# Altium schematic sheet Sheet1.SchDoc: GAS LEAKAGE SETECTOR
size A4; DrawnBy: M.W.R.Prabuddhika; Revision: 1; SheetNumber: 1; SheetTotal: 1
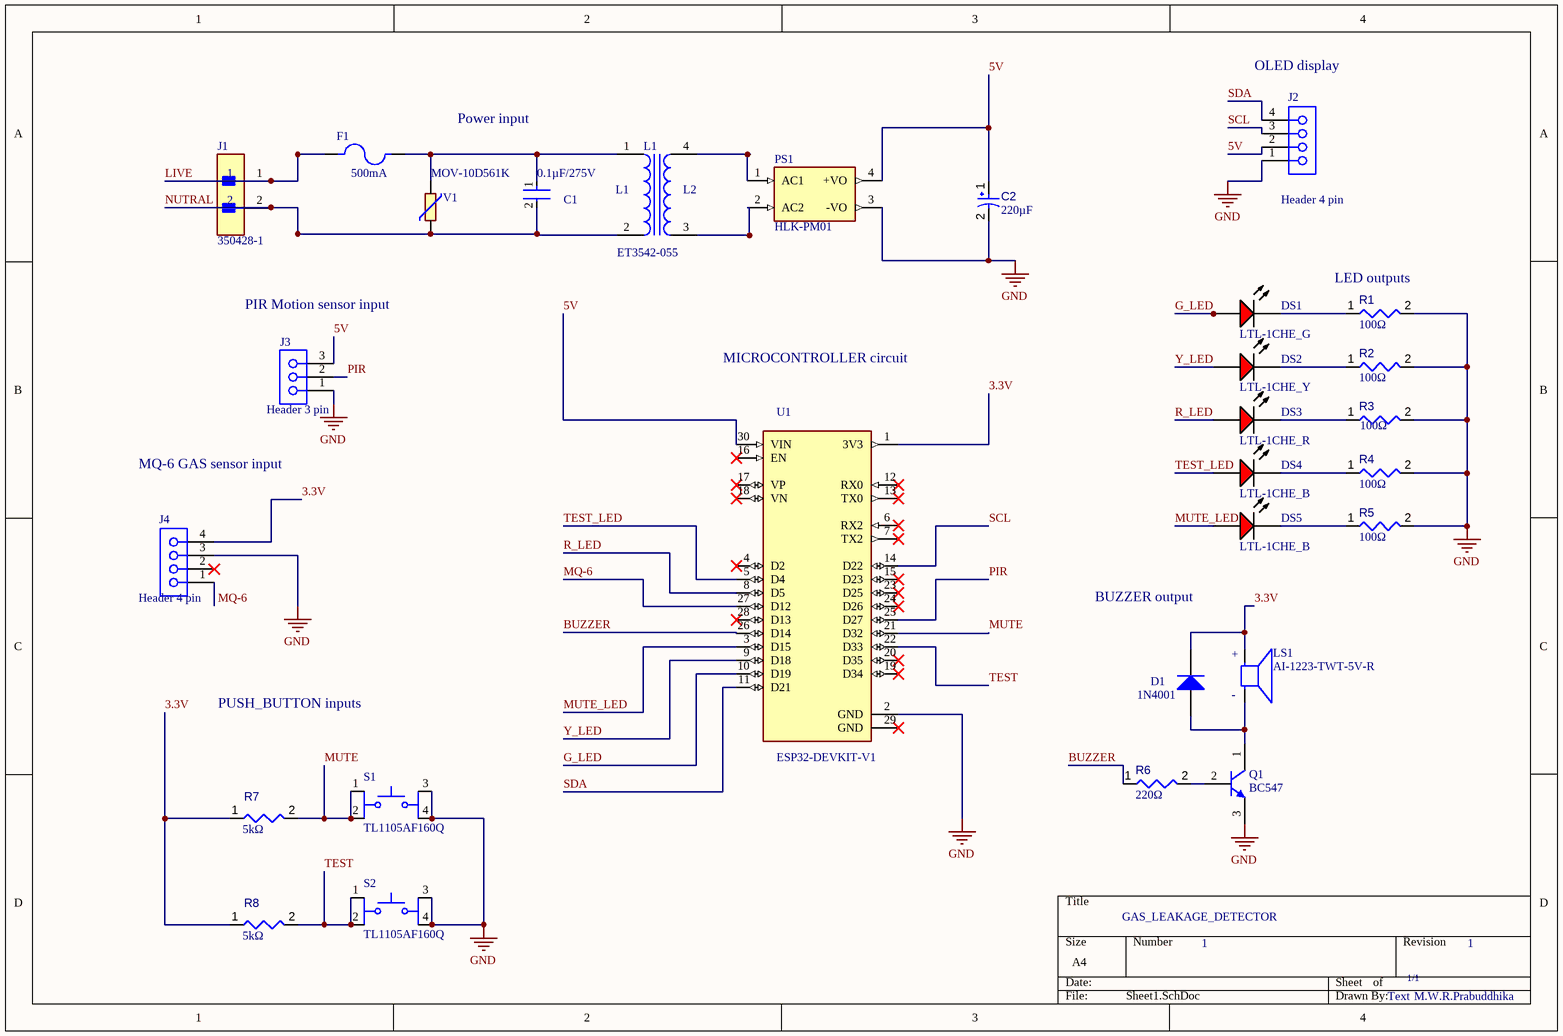
[diagram p0: Sheet1.SchDoc]

## Parts
C1  0.1µF/275V  [FP-PMR209MC6100M100R30-MFG]
C2  value 220µF  [CAPPR65-500-1250X1000X1350]  (hidden comment: ECA-1HM221)
D1  1N4001  [FAIR-DO-41-2]
DS1  LTL-1CHE_G  [INDPR60-254-520X380X650]
DS2  LTL-1CHE_Y  [INDPR60-254-520X380X650]
DS3  LTL-1CHE_R  [INDPR60-254-520X380X650]
DS4  LTL-1CHE_B  [INDPR60-254-520X380X650]
DS5  LTL-1CHE_B  [INDPR60-254-520X380X650]
F1  500mA  [FUSE_4628]
J1  350428-1  [FP-350428-1-MFG]
J2  OLED display  [SMTC-SLW-104-01-X-S]
J3  Header 3 pin  [SMTC-SLW-103-01-X-S]
J4  MQ-6 GAS sensor input  [SMTC-SLW-104-01-X-S]
L1  ET3542-055  [IND_ET3542-055]
LS1  AI-1223-TWT-5V-R  [XDCR_AI-1223-TWT-5V-R]
PS1  HLK-PM01  [CONV_HLK-PM01]
Q1  BC547  [ONSC-TO-92-3-29-11_AM_BL]
R1  value 100Ω  [RESA60-630X240]  (hidden comment: MFR-25FBF52-1K)
R2  value 100Ω  [RESA60-630X240]  (hidden comment: MFR-25FBF52-1K)
R3  value 100Ω  [RESA60-630X240]  (hidden comment: MFR-25FBF52-1K)
R4  value 100Ω  [RESA60-630X240]  (hidden comment: MFR-25FBF52-1K)
R5  value 100Ω  [RESA60-630X240]  (hidden comment: MFR-25FBF52-1K)
R6  value 220Ω  [RESA60-630X240]  (hidden comment: MFR-25FBF52-1K)
R7  value 5kΩ  [RESA60-630X240]  (hidden comment: MFR-25FBF52-1K)
R8  value 5kΩ  [RESA60-630X240]  (hidden comment: MFR-25FBF52-1K)
S1  TL1105AF160Q  [SW_TL1105AF160Q]
S2  TL1105AF160Q  [SW_TL1105AF160Q]
U1  ESP32-DEVKIT-V1  [MODULE_ESP32_DEVKIT_V1]
V1  MOV-10D561K  [MOV-10D561]

## Nets
GND: C2.2 J2.1 J3.1 J4.3 PS1.3(-VO) Q1.3(E) R1.2 R2.2 R3.2 R4.2 R5.2 S1.3 S1.4 S2.3 S2.4 U1.2(GND)
3.3V: D1.1(K) J4.4 LS1.P(POS) R7.1 R8.1 U1.1(3V3)
5V: C2.1 J2.2 J3.3 PS1.4(+VO) U1.30(VIN)
BUZZER: R6.1 U1.26(D14)
G_LED: DS1.1(A) U1.10(D19)
LIVE: F1.1 J1.1
MQ-6: U1.27(D12)
MUTE: R7.2 S1.1 S1.2 U1.21(D32)
MUTE_LED: DS5.1(A) U1.3(D15)
NUTRAL: C1.2 J1.2 L1.2 V1.2
PIR: J3.2 U1.25(D27)
R_LED: DS3.1(A) U1.8(D5)
SCL: J2.3 U1.14(D22)
SDA: J2.4 U1.11(D21)
TEST: R8.2 S2.1 S2.2 U1.22(D33)
TEST_LED: DS4.1(A) U1.5(D4)
Y_LED: DS2.1(A) U1.9(D18)
NetC1_1: C1.1 F1.2 L1.1 V1.1
NetD1_2: D1.2(A) LS1.N(NEG) Q1.1(C)
NetDS1_2: DS1.2(K) R1.1
NetDS2_2: DS2.2(K) R2.1
NetDS3_2: DS3.2(K) R3.1
NetDS4_2: DS4.2(K) R4.1
NetDS5_2: DS5.2(K) R5.1
NetL1_3: L1.3 PS1.2(AC2)
NetL1_4: L1.4 PS1.1(AC1)
NetQ1_2: Q1.2(B) R6.2

Not connected (* = marked no-connect by the designer): J4 1 2*; U1 4(D2)* 6(RX2)* 7(TX2)* 12(RX0)* 13(TX0)* 15(D23)* 16(EN)* 17(VP)* 18(VN)* 19(D34)* 20(D35)* 23(D25)* 24(D26)* 28(D13)* 29(GND)*

## Notes on the sheet
- Power input
- (near J2) Header 4 pin
- (near J3) PIR Motion sensor input
- (near R1) LED outputs
- MICROCONTROLLER circuit
- (near J4) Header 4 pin
- BUZZER output
- PUSH_BUTTON inputs
- GAS_LEAKAGE_DETECTOR
- 1
- 1/1
- Text
- M.W.R.Prabuddhika
- Labels drawn without touching a wire or pin: MQ-6
- (in symbol AI-1223-TWT-5V-R) +; -
- (in symbol CMP-017-000000-1) L2

## Library data of the parts
C1 = CMP-03022-000018-1: FILTER RC 100 OHM/0.1UF TH; Pitch: 20.3mm; Voltage: 630V; Number of Elements: 1; Resistance Tolerance: 30%; Dielectric Material: Paper; Capacitance: 100nF; Voltage Rating (AC): 250V; Number of Terminals/Pins: 2; Resistance: 100R; Tolerance: 20%; Lead Diameter: 0.8mm; Width: 7.6mm; Terminal Pitch: 20.3mm; Min Operating Temperature: -40°C; Series: PMR209; Height - Seated (Max): 0.551inch; Length: 24mm; Height: 14mm; Termination: Radial; Radiation Hardening: No; Max Operating Temperature: 85°C; REACH SVHC: No SVHC; Depth: 7.6mm; Mount: Through Hole; Construction: RADIAL; Number of Pins: 2; Case/Package: Radial; Packaging: Bulk; Lead Pitch: 20.3mm; Voltage Rating: 250V; RoHS Compliant: Yes; Series Resistance: 100R; Package Quantity: 250
C2 = CMP-001-00028-7: Aluminum Electrolytic Capacitor, 220 uF, +/- 20%, 50 V, -40 to 85 degC, 2-Pin THD, RoHS, Bulk; Manufacturer: Panasonic; Ripple Current (AC): 400mA; Voltage Rating: 50V; Case/Package: Radial; Packaging: Bulk; Package Quantity: 200; Min Operating Temperature: -40°C; Datasheet Version: Mar-16; Package Reference: CAPPR65-500-1250X1000X1350; Mounting Technology: TH; Ripple Current: 400mA; Pins: 2; Package Description: 2-Pin Radial Lead, Dia 10 mm, Body Length 12.5 mm; RoHS Compliant: True; Max Operating Temperature: 85°C; Lead Pitch: 5mm; Tolerance: 20%; Manufacturer URL: http://www.panasonic.com/; Diameter: 10mm; Capacitor Type: Electrolytic; Datasheet URL: http://industrial.panasonic.com/cdbs/www-data/pdf/RDF0000/DMF0000COL68.pdf
D1 = CMP-004-00007-2: General Purpose Rectifier, 1.1 V, 1.0 A, -55 to 175 degC, 2-Pin DO-41, RoHS, Tape and Reel; Manufacturer: Fairchild; Peak Reverse Current: 5uA; Max Surge Current: 30A; Elements: 1; Forward Voltage: 1.1V; Package Version: Rev. 2, 09/2008; Forward Current: 1A; Package Quantity: 5000; Packaging: TapeandReel; Package URL: http://www.fairchildsemi.com/dwg/DO/DO41A.pdf; Manufacturer URL: https://www.fairchildsemi.com/; Package Reference: DO-41-2; Pins: 2; Min Operating Temperature: -55°C; Datasheet Version: Rev. 1.1.0, 11/2014; Max Operating Temperature: 175°C; RoHS Compliant: True; Case/Package: DO-41-2; Mounting Technology: TH; Package Description: 2-Pin Axial Lead, Dia 2.375 mm, Body Length 4.63 mm; Datasheet URL: https://www.fairchildsemi.com/datasheets/1N/1N4007.pdf
DS1-DS5 = CMP-007-00018-2: LED Uni-Color Red, 100 mW, 30 mA, -55 to 100 degC, 2-Pin THD, RoHS, Bulk; Manufacturer: Lite-On; Forward Current: 20mA; Nominal Vf: 2V; Viewing Angle: 60degrees; Luminous Intensity: 12.6mcd; Lens Style: Dome; Pins: 2; RoHS Compliant: True; Package Reference: LTL-1CHE; Package Quantity: 1000; Mounting Technology: TH; Min Operating Temperature: -55°C; Colour: Red; Case/Package: Radial; Manufacturer URL: http://www.us.liteon.com/; Datasheet URL: https://datasheet.ciiva.com/15117/getdatasheetpartid-187746-15117985.pdf; Forward Voltage: 2V; Max Operating Temperature: 100°C; Illumination Colour: Red; Package Description: 2-Pin Through Hole Device, Dia 3.8 mm, Pitch 2.54 mm; Packaging: Bulk; Datasheet Version: Dec-03
F1 = CMP-005-00013-1: 5mm Slim Line Fuse holder; MF: Keystone; Availability: In Stock; Pins: 2; Purchase-URL: https://pricing.snapeda.com/search/part/4628/?ref=eda; Design Item ID: 4628; Price: None; Component Type: Standard; Value: *; Source: 4628.SchLib; MP: 4628; SnapEDA_Link: https://www.snapeda.com/parts/4628/Keystone/view-part/?ref=snap; Check_prices: https://www.snapeda.com/parts/4628/Keystone/view-part/?ref=eda; Case/Package: None
J1 = CMP-03369-000080-1: CONN HEADER VERT 2POS 6.35MM; Manufacturer: TE Connectivity; Standoff Height: 0.63mm; Number Of Contacts: 2; Conn Gender: Male; Voltage Rating: 600V; Conn Orientation: Vertical; Current Rating: 12A; Number Of Rows: 1; Mouser Description: Connector, Soft Shell; Universal MATE-N-LOK; 2; Nylon; Natural; 19 A; 600 VAC; Height: 14.99mm; Pitch: 6.35mm; ComponentLink2URL: https://www.te.com/commerce/DocumentDelivery/DDEController?Action=showdoc&DocId=Customer+Drawing%7F350428%7FY2%7Fpdf%7FEnglish%7FENG_CD_350428_Y2.pdf%7F350428-1; Device Class L1: Connectors; Automotive: No; Octopart: https://octopart.com/350428-1-te+connectivity-46505355; Digikey Description: CONN HEADER VERT 2POS 6.35MM; RoHS: TRUE; Temperature: -40°C to +105°C; Contact Material: Gold,Nickel; Package: 350428-1; Temperature Range Low: -40°C; Device Class L3: unset; Lead Free: Yes; Device Class L2: Headers and Wire Housings; Category: Conn; ComponentLink2Description: Datasheet; Temperature Range High: +105°C; Manufacturer Part Number: 350428-1
J2 J4 = CMP-1023-00130-1: Low Profile Socket Strips, Through-hole, Vertical, -55 to 125 degC, 2.54 mm Pitch, 4-Pin, Female, RoHS; Manufacturer: Samtec; PartNumber: SLW-104-01-G-S; Pitch: 2.54 mm; PackageReference: SLW-104-01-X-S; Orientation: Vertical; ComponentLink1Description: Manufacturer URL; PackageVersion: X, 9/1987; RoHS: True; Temperature Range: -55 to 125 degC; DatasheetVersion: F-214; ComponentLink3URL: http://www.samtec.com/documents/webfiles/cpdf/SLW-1XX-01-X-X-MKT.pdf; Mounting Technology: Through-hole; PackageDescription: Low Profile Socket Strip; ComponentLink2Description: Datasheet; ComponentLink3Description: Package Specification; ComponentLink2URL: http://www.samtec.com/documents/webfiles/pdf/SLW.PDF; ComponentLink1URL: http://www.samtec.com
J3 = CMP-1023-00128-1: Low Profile Socket Strips, Through-hole, Vertical, -55 to 125 degC, 2.54 mm Pitch, 3-Pin, Female, RoHS; Manufacturer: Samtec; PartNumber: SLW-103-01-G-S; Pitch: 2.54 mm; ComponentLink2URL: http://www.samtec.com/documents/webfiles/pdf/SLW.PDF; PackageVersion: X, 9/1987; ComponentLink2Description: Datasheet; Mounting Technology: Through-hole; RoHS: True; ComponentLink3URL: http://www.samtec.com/documents/webfiles/cpdf/SLW-1XX-01-X-X-MKT.pdf; PackageDescription: Low Profile Socket Strip; Temperature Range: -55 to 125 degC; DatasheetVersion: F-214; ComponentLink1Description: Manufacturer URL; ComponentLink1URL: http://www.samtec.com; Orientation: Vertical; PackageReference: SLW-103-01-X-S; ComponentLink3Description: Package Specification
L1 = CMP-017-000000-1: COMMON MODE CHOKE 10.0mH@2.7Arms; MF: Triad Magnetics; Price: None; Availability: Unavailable; SnapEDA_Link: https://www.snapeda.com/parts/ET3542-055/Triad%20Magnetics/view-part/1583149/?ref=snap; Package: Vertical-4 Triad Magnetics; MP: ET3542-055; Source: SnapEDAsch.SchLib; Design Item ID: ET3542-055; Pin Count: 4; Value: *; Component Type: Standard
LS1 = AI-1223-TWT-5V-R: ELECTRO MECHANICAL AUDIO INDICATOR; MF: PUI Audio,; Price: None; Availability: In Stock; MP: AI-1223-TWT-5V-R; Package: 2225 PUI Audio; SnapEDA_Link: https://www.snapeda.com/parts/AI-1223-TWT-5V-R/PUI+Audio%252C+Inc./view-part/?ref=snap; Check_prices: https://www.snapeda.com/parts/AI-1223-TWT-5V-R/PUI+Audio%252C+Inc./view-part/?ref=eda; Value: *; Purchase-URL: https://pricing.snapeda.com/search/part/AI-1223-TWT-5V-R/?ref=eda
PS1 = CMP-009-000000-1: The HLK-PM01 is a small size low cost AC to DC converter which can take in 110V/220V AC at 50/60 Hz and give 5V 3W output. The module is can be used in designs which run on 5V and needs to be powered form the AC mains.; MF: Hi-link; MP: hlk-pm01; Source: HLK-PM01.SchLib; Package: None; Price: None; Pin Count: 4; Check_prices: https://www.snapeda.com/parts/hlk-pm01/Hi-link/view-part/?ref=eda; Component Type: Standard; Value: *; Availability: Not in stock; Design Item ID: HLK-PM01; SnapEDA_Link: https://www.snapeda.com/parts/hlk-pm01/Hi-link/view-part/?ref=snap
Q1 = CMP-1048-01605-1: Amplifier Transistor, NPN Silicon, 3-Pin TO-92, Pb-Free, Tape and Reel; Manufacturer: On Semiconductor; PartNumber: BC547BRL1G; IC Continuous (A): 0.1; fT Min (MHz): 150; ComponentLink2URL: http://www.onsemi.com/pub_link/Collateral/BC546-D.PDF; ComponentLink1URL: http://www.onsemi.com/; ComponentLink2Description: Datasheet; RoHS: TRUE; ComponentLink3Description: Package Specification; ComponentLink1Description: Manufacturer URL; ComponentLink3URL: http://www.onsemi.com/pub_link/Collateral/MAC97-D.PDF; PackageDescription: 3-Pin Transistor Outline, Body 4.825 x 3.685 mm, Pitch 1.27 mm; Packing: Tape and Reel; PackageVersion: Rev. AM; Polarity: NPN; DatasheetVersion: Rev. 7; Mounting Technology: Through Hole; PackageReference: TO-92-3-29-11_AM_BL
R1-R8 = CMP-009-00048-4: Axial Resistor, 1 KOhm, +/- 1%, 250 mW, -55 to 155 degC, 2-Pin THD, RoHS, Bulk; Manufacturer: Yageo; Voltage Rating: 250V; Power: 250mW; Min Operating Temperature: -55°C; Max Operating Temperature: 155°C; Tolerance: 1%; Package Reference: MFR-25; Composition: CarbonFilm; Mounting Technology: TH; Packaging: Bulk; Case/Package: Axial; Datasheet URL: http://www.yageo.com/documents/recent/Yageo%20LR_MFR_2013.pdf; Package Quantity: 200; Manufacturer URL: http://www.yageo.com/; Package Description: 2-Pin Axial Lead, Dia 2.4 mm, Body Length 6.3 mm; Datasheet Version: Apr-13; RoHS Compliant: True
S1 S2 = CMP-007-000000-1: Value: *; Package: None; Pin Count: 4; Price: None; Design Item ID: TL1105AF160Q; MP: TL1105AF160Q; Availability: Unavailable; Component Type: Standard; Source: TL1105AF160Q.SchLib
U1 = ESP32-DEVKIT-V1: Dual core, Wi-Fi: 2.4 GHz up to 150 Mbits/s,BLE (Bluetooth Low Energy) and legacy Bluetooth, 32 bits, Up to 240 MHz; MF: Do it; Price: None; Availability: Not in stock; Package: None; MP: ESP32-DEVKIT-V1; Value: *; SnapEDA_Link: https://www.snapeda.com/parts/ESP32-DEVKIT-V1/Do+it/view-part/?ref=snap; Check_prices: https://www.snapeda.com/parts/ESP32-DEVKIT-V1/Do+it/view-part/?ref=eda
V1 = CMP-013-000000-1: 560 V 2.5 kA Varistor 1 Circuit Through Hole Disc 10mm; MF: Bourns; Value: *; Price: None; Source: MOV-10D561K.SchLib; Purchase-URL: https://pricing.snapeda.com/search/part/MOV-10D561K/?ref=eda; Design Item ID: MOV-10D561K; Pin Count: 2; SnapEDA_Link: https://www.snapeda.com/parts/MOV-10D561K/Bourns/view-part/?ref=snap; Availability: In Stock; Check_prices: https://www.snapeda.com/parts/MOV-10D561K/Bourns/view-part/?ref=eda; MP: MOV-10D561K; Component Type: Standard; Package: Disc-10 Bourns